# Altium schematic sheet RELAY_DRIVER.SchDoc
size A; SheetNumber: 3; SheetTotal: 3
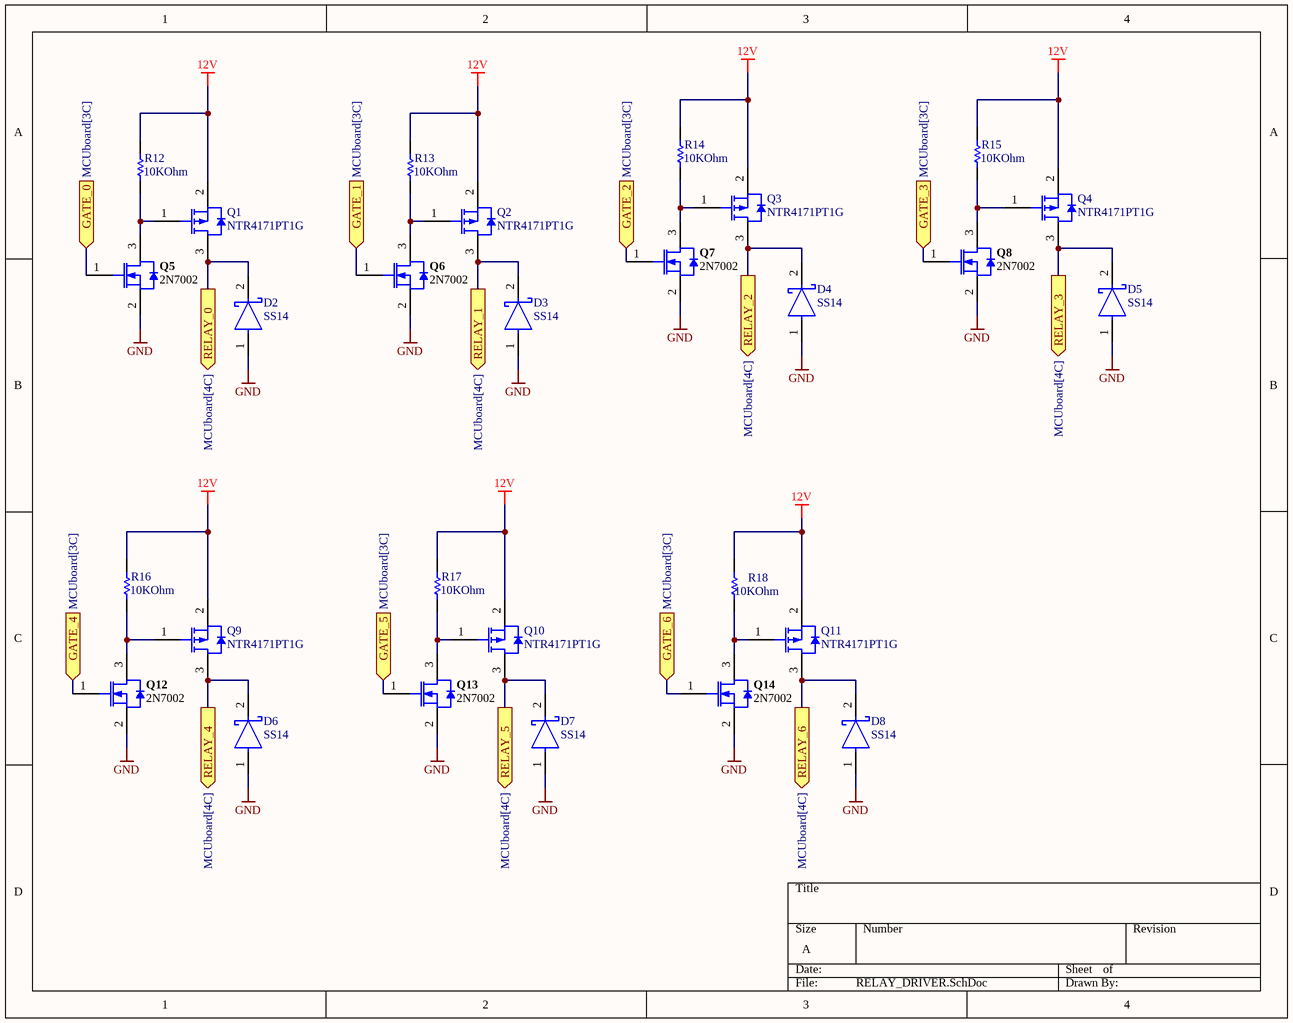
[diagram p0: RELAY_DRIVER.SchDoc]

## Parts
D2  SS14  [FP-403AE-MFG]
D3  SS14  [FP-403AE-MFG]
D4  SS14  [FP-403AE-MFG]
D5  SS14  [FP-403AE-MFG]
D6  SS14  [FP-403AE-MFG]
D7  SS14  [FP-403AE-MFG]
D8  SS14  [FP-403AE-MFG]
Q1  NTR4171PT1G  [ONSC-SOT-23-3-318-08_V]
Q2  NTR4171PT1G  [ONSC-SOT-23-3-318-08_V]
Q3  NTR4171PT1G  [ONSC-SOT-23-3-318-08_V]
Q4  NTR4171PT1G  [ONSC-SOT-23-3-318-08_V]
Q5  2N7002  [INF-PG-SOT23_M]
Q6  2N7002  [INF-PG-SOT23_M]
Q7  2N7002  [INF-PG-SOT23_M]
Q8  2N7002  [INF-PG-SOT23_M]
Q9  NTR4171PT1G  [ONSC-SOT-23-3-318-08_V]
Q10  NTR4171PT1G  [ONSC-SOT-23-3-318-08_V]
Q11  NTR4171PT1G  [ONSC-SOT-23-3-318-08_V]
Q12  2N7002  [INF-PG-SOT23_M]
Q13  2N7002  [INF-PG-SOT23_M]
Q14  2N7002  [INF-PG-SOT23_M]
R12  Resistance: 10KOhm  [RESC1609X55X30LL15T15]  (hidden comment: ERJ3EKF1002V)
R13  Resistance: 10KOhm  [RESC1609X55X30LL15T15]  (hidden comment: ERJ3EKF1002V)
R14  Resistance: 10KOhm  [RESC1609X55X30LL15T15]  (hidden comment: ERJ3EKF1002V)
R15  Resistance: 10KOhm  [RESC1609X55X30LL15T15]  (hidden comment: ERJ3EKF1002V)
R16  Resistance: 10KOhm  [RESC1609X55X30LL15T15]  (hidden comment: ERJ3EKF1002V)
R17  Resistance: 10KOhm  [RESC1609X55X30LL15T15]  (hidden comment: ERJ3EKF1002V)
R18  Resistance: 10KOhm  [RESC1609X55X30LL15T15]  (hidden comment: ERJ3EKF1002V)

## Ports
GATE_0 (in, see MCUboard[3C]), GATE_1 (in, see MCUboard[3C]), GATE_2 (in, see MCUboard[3C]), GATE_3 (in, see MCUboard[3C]), GATE_4 (in, see MCUboard[3C]), GATE_5 (in, see MCUboard[3C]), GATE_6 (in, see MCUboard[3C]), RELAY_0 (out, see MCUboard[4C]), RELAY_1 (out, see MCUboard[4C]), RELAY_2 (out, see MCUboard[4C]), RELAY_3 (out, see MCUboard[4C]), RELAY_4 (out, see MCUboard[4C]), RELAY_5 (out, see MCUboard[4C]), RELAY_6 (out, see MCUboard[4C])

## Nets
12V: Q1.2(S) Q2.2(S) Q3.2(S) Q4.2(S) Q9.2(S) Q10.2(S) Q11.2(S) R12.2 R13.2 R14.2 R15.2 R16.2 R17.2 R18.2
GND: D2.1(A) D3.1(A) D4.1(A) D5.1(A) D6.1(A) D7.1(A) D8.1(A) Q5.2(SOURCE) Q6.2(SOURCE) Q7.2(SOURCE) Q8.2(SOURCE) Q12.2(SOURCE) Q13.2(SOURCE) Q14.2(SOURCE)
GATE_0: Q5.1(GATE) ; port GATE_0
GATE_1: Q6.1(GATE) ; port GATE_1
GATE_2: Q7.1(GATE) ; port GATE_2
GATE_3: Q8.1(GATE) ; port GATE_3
GATE_4: Q12.1(GATE) ; port GATE_4
GATE_5: Q13.1(GATE) ; port GATE_5
GATE_6: Q14.1(GATE) ; port GATE_6
RELAY_0: D2.2(C) Q1.3(D) ; port RELAY_0
RELAY_1: D3.2(C) Q2.3(D) ; port RELAY_1
RELAY_2: D4.2(C) Q3.3(D) ; port RELAY_2
RELAY_3: D5.2(C) Q4.3(D) ; port RELAY_3
RELAY_4: D6.2(C) Q9.3(D) ; port RELAY_4
RELAY_5: D7.2(C) Q10.3(D) ; port RELAY_5
RELAY_6: D8.2(C) Q11.3(D) ; port RELAY_6
NetQ1_1: Q1.1(G) Q5.3(DRAIN) R12.1
NetQ2_1: Q2.1(G) Q6.3(DRAIN) R13.1
NetQ3_1: Q3.1(G) Q7.3(DRAIN) R14.1
NetQ4_1: Q4.1(G) Q8.3(DRAIN) R15.1
NetQ9_1: Q9.1(G) Q12.3(DRAIN) R16.1
NetQ10_1: Q10.1(G) Q13.3(DRAIN) R17.1
NetQ11_1: Q11.1(G) Q14.3(DRAIN) R18.1

## Library data of the parts
D2-D8 = CMP-2000-04943-2: DIODE SCHOTTKY 40V 1A SMA; Manufacturer: ON Semiconductor; Peak Reverse Current: 0.2mA; Max Junction Temp: +125°C; Standoff Height: 0.05mm; Max Surge Forward Current: 40A; Mouser Description: Schottky Diodes & Rectifiers SMA 40V 1.0A; RoHS: TRUE; Lead Free: Yes; Manufacturer Part Number: SS14; Device Class L3: Schottky Diodes; Category: Diode; Automotive: No; Digikey Description: DIODE SCHOTTKY 40V 1A SMA; ComponentLink2Description: Datasheet; Device Class L2: Diodes; Height: 2.5mm; Temperature Range High: +125°C; ComponentLink2URL: https://www.onsemi.com/pub/Collateral/SS19-D.PDF; Device Class L1: Discrete Semiconductors; Package: 403AE; Octopart: https://octopart.com/ss14-on+semiconductor-29205033; Max Repetitive Reverse Voltage: 40V; Temperature Range Low: -65°C; Forward Current: 1A; Temperature: -65°C to +125°C
Q1-Q4 Q9-Q11 = CMP-1058-00738-1: Power MOSFET, -30 V, 3.5 A, Single P-Channel, 3-Pin SOT-23, Pb-Free, Tape and Reel; Manufacturer: On Semiconductor; VGS Max (V): 12; V(BR)DSS Min (V): 30; Crss Typ (pF): 65; VGS(th) Max (V): 1.4; Ciss Typ (pF): 720; Qrr Typ (nC): 8; Coss Typ (pF): 95; Channel Polarity: P Channel; ComponentLink2URL: http://www.onsemi.cn/pub_link/Collateral/NTR4171P-D.PDF; ComponentLink1Description: Manufacturer URL; PartNumber: NTR4171PT1G; Mounting Technology: Surface Mount; ComponentLink1URL: http://www.onsemi.com/; Packing: Tape and Reel; Package Type: SOT-23-3; ComponentLink2Description: Datasheet; PackageReference: SOT-23-3-318-08; Configuration: Single; ComponentLink3Description: Package Specification; DatasheetVersion: Rev. 1; PackageVersion: Rev. AP, 11/2009; RoHS: Pb-Free; PackageDescription: 3-Pin Small Outline Transistor, Body 2.92 x 1.3 mm, Pitch 0.95 mm; ComponentLink3URL: http://www.onsemi.cn/pub_link/Collateral/318-08.PDF
Q5-Q8 Q12-Q14 = CMP-1149-00026-1: N-Channel OptiMOS Small-Signal-Transistor, 60 V VDS, 0.3 A ID, -55 to 150 degC, PG-SOT23, Reel, Green; Manufacturer: Infineon; RDS (on) (max) (@4.5V): 4,000 mOhm; VDS (max): 60 V; IDpuls (max): 1.2Â A; QG: 0.4Â nC; RDS (on) (max): 3,000 mOhm; RthJA (max): 250 K/W; ID (max): 0.3Â A; VGS(th) (max): 2.5Â V; VGS(th) (min): 1.5Â V; Green: TRUE; Ptot (max): 0.5Â W; PackageDescription: 3-Pin Small Outline Transistor Package, 2.9 x 1.3 mm Body, 0.95 mm Pitch; Halogen-free: TRUE; ComponentLink2Description: Datasheet; ComponentLink1URL: http://www.infineon.com/; Packing: Reel; DatasheetVersion: Rev. 2.4; PartNumber: 2N7002; PackageReference: PG-SOT23; PackageVersion: Apr-08; ComponentLink3URL: http://www.infineon.com/dgdl/SOT23-Package_Overview.pdf?folderId=db3a30431936bc4b0119532290053c66&fileId=db3a30431936bc4b0119533468123c85; ComponentLink1Description: Manufacturer URL; Mounting Technology: Surface Mount; ComponentLink3Description: Package Specification; ComponentLink2URL: http://www.infineon.com/dgdl/2N7002_Rev2.4.pdf?folderId=db3a3043156fd573011622e10b5c1f67&fileId=db3a304319bc939a0119c2a9461e79e6
R12-R18 = CMP-1012-00623-3: Chip Resistor, 10 KOhm, +/- 1%, 0.1 W, -55 to 155 degC, 0603 (1608 Metric), RoHS, Tape and Reel; Manufacturer: Panasonic; Voltage Rating: 75V; Case\/Package: 0603; Power Rating: 100mW; Temperature Coefficient: 100ppm\/degreesC; Number of Pins: 2; Package Reference: 603; Depth: 0.8mm; Mount: SurfaceMount; Package Description: 2-Pin Surface Mount Device, Body 1.6 x 0.85 mm; Datasheet Version: 02/2017; Length: 1.6mm; Lead Free: LeadFree; Height: 0.45mm; Number of Terminations: 2; Max Power Dissipation: 100mW; Min Operating Temperature: -55degC; Datasheet URL: https://industrial.panasonic.com/cdbs/www-data/pdf/RDA0000/AOA0000C304.pdf; Termination: SMD/SMT; Case Code (Metric): 1608; Case Code (Imperial): 0603; Tolerance: 1%; Max Operating Temperature: 155degC; RoHSCompliant: true; Voltage Rating (DC): 75V; Radiation Hardening: No; Packaging: TapeandReel; Composition: ThickFilm; Mounting Technology: SurfaceMount; Manufacturer URL: http://www.panasonic.com/; Width: 0.031inch; REACH SVHC: NoSVHC; Contact Plating: Tin; Military Standard: Not; Package Quantity: 1